# EAGLE design MusicReactiveLEDStrip-V2 (EAGLE 8.4.0)
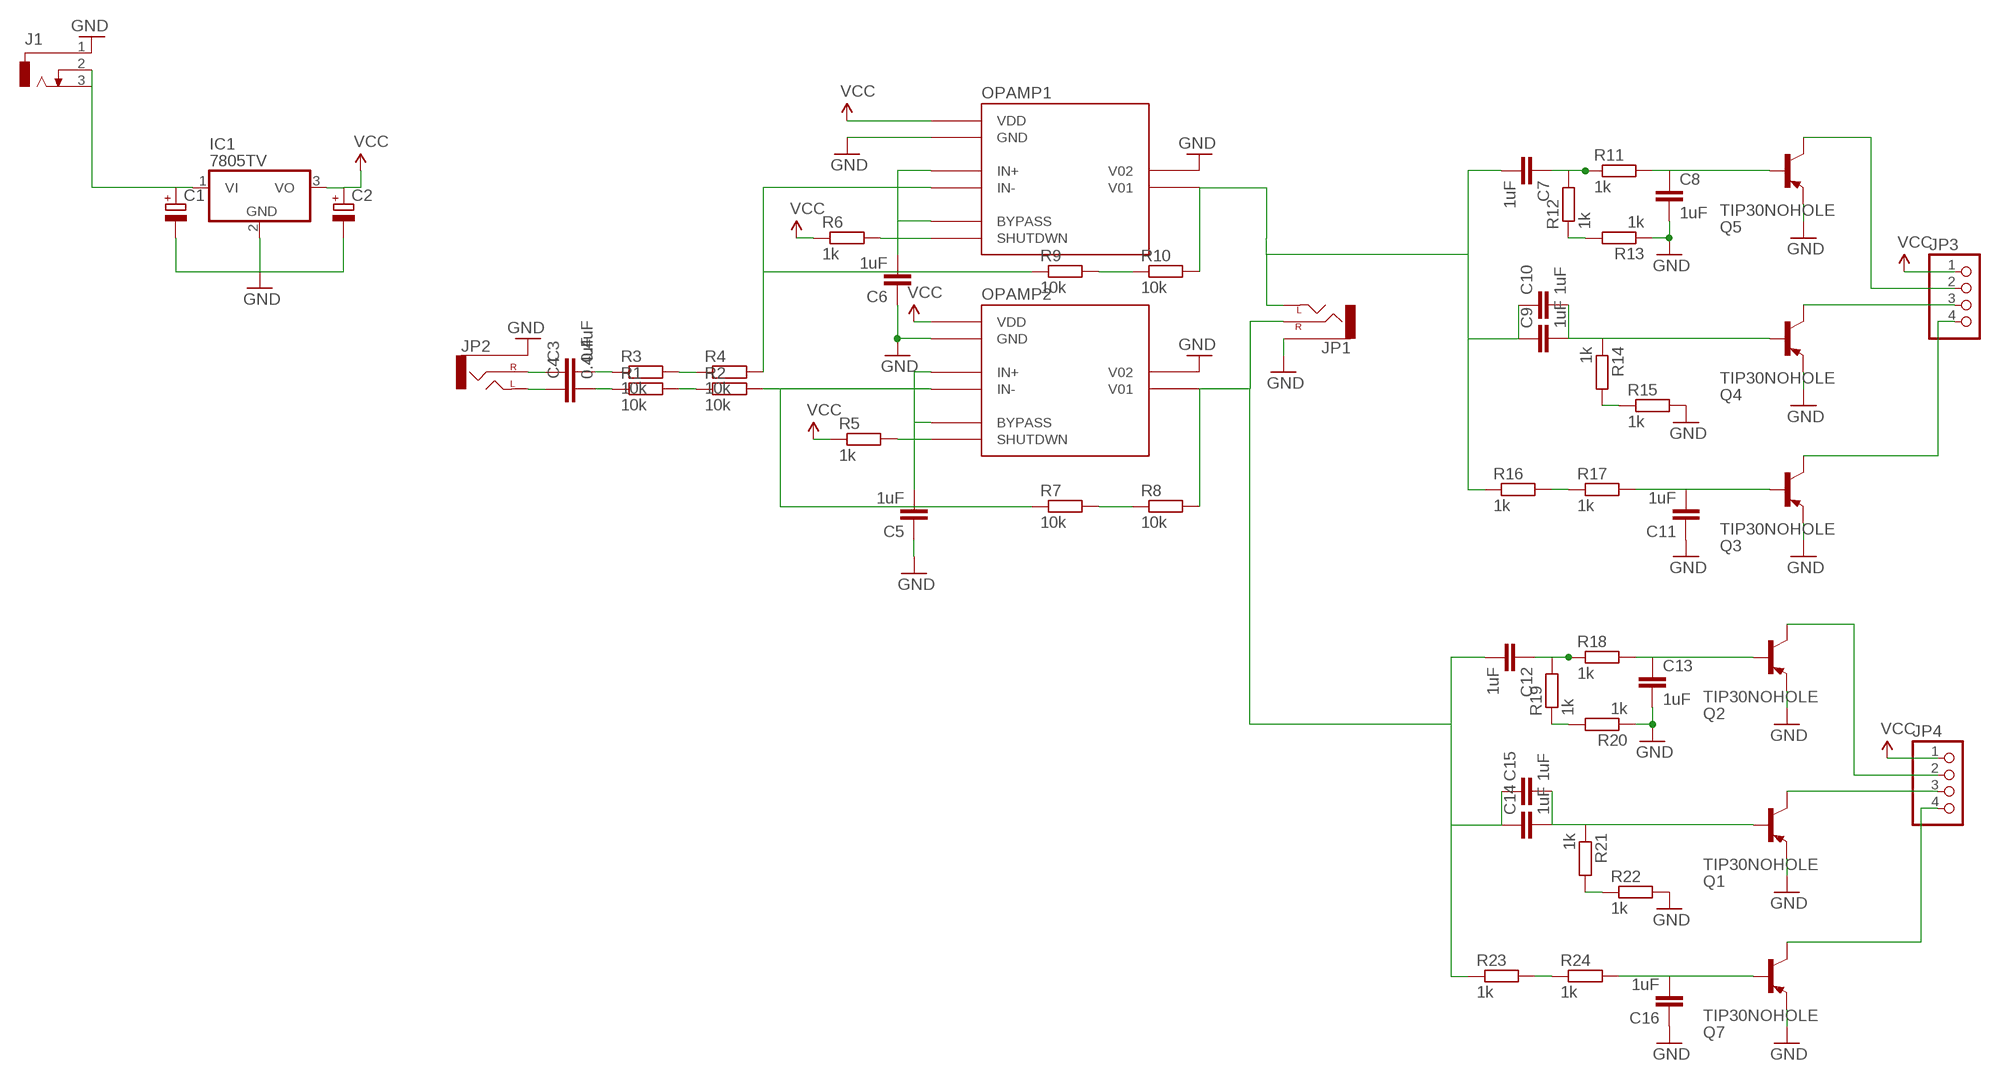
[diagram p0: schematic, sheet 1]

## Parts
C1  CPOL-EUE2.5-6  [E2,5-6]
C2  CPOL-EUE2.5-6  [E2,5-6]
C3  0.4uF  C-EU050-025X075  [C050-025X075]
C4  0.4uF  C-EU050-025X075  [C050-025X075]
C5  1uF  C-EU050-025X075  [C050-025X075]
C6  1uF  C-EU050-025X075  [C050-025X075]
C7  1uF  C-EU050-025X075  [C050-025X075]
C8  1uF  C-EU050-025X075  [C050-025X075]
C9  1uF  C-EU050-025X075  [C050-025X075]
C10  1uF  C-EU050-025X075  [C050-025X075]
C11  1uF  C-EU050-025X075  [C050-025X075]
C12  1uF  C-EU050-025X075  [C050-025X075]
C13  1uF  C-EU050-025X075  [C050-025X075]
C14  1uF  C-EU050-025X075  [C050-025X075]
C15  1uF  C-EU050-025X075  [C050-025X075]
C16  1uF  C-EU050-025X075  [C050-025X075]
IC1  7805TV  [TO220V]
J1  DCJ0303  [DCJ0303]
JP1  AUDIO-JACKPTH  [AUDIO-JACK]
JP2  AUDIO-JACKPTH  [AUDIO-JACK]
JP3  PINHD-1X4  [1X04]
JP4  PINHD-1X4  [1X04]
OPAMP1  LM4871  [SO08]
OPAMP2  LM4871  [SO08]
Q1  TIP30NOHOLE  [TO220-NOHOLE]
Q2  TIP30NOHOLE  [TO220-NOHOLE]
Q3  TIP30NOHOLE  [TO220-NOHOLE]
Q4  TIP30NOHOLE  [TO220-NOHOLE]
Q5  TIP30NOHOLE  [TO220-NOHOLE]
Q7  TIP30NOHOLE  [TO220-NOHOLE]
R1  10k  R-EU_0207/10  [0207/10]
R2  10k  R-EU_0207/10  [0207/10]
R3  10k  R-EU_0207/10  [0207/10]
R4  10k  R-EU_0207/10  [0207/10]
R5  1k  R-EU_0207/10  [0207/10]
R6  1k  R-EU_0207/10  [0207/10]
R7  10k  R-EU_0207/10  [0207/10]
R8  10k  R-EU_0207/10  [0207/10]
R9  10k  R-EU_0207/10  [0207/10]
R10  10k  R-EU_0207/10  [0207/10]
R11  1k  R-EU_0207/10  [0207/10]
R12  1k  R-EU_0207/10  [0207/10]
R13  1k  R-EU_0207/10  [0207/10]
R14  1k  R-EU_0207/10  [0207/10]
R15  1k  R-EU_0207/10  [0207/10]
R16  1k  R-EU_0207/10  [0207/10]
R17  1k  R-EU_0207/10  [0207/10]
R18  1k  R-EU_0207/10  [0207/10]
R19  1k  R-EU_0207/10  [0207/10]
R20  1k  R-EU_0207/10  [0207/10]
R21  1k  R-EU_0207/10  [0207/10]
R22  1k  R-EU_0207/10  [0207/10]
R23  1k  R-EU_0207/10  [0207/10]
R24  1k  R-EU_0207/10  [0207/10]

## Nets
GND: C1.- C2.- C5.1 C6.1 C8.2 C11.1 C13.2 C16.1 IC1.2(GND) J1.1 JP1.SLEEVE JP2.SLEEVE OPAMP1.7(GND) OPAMP1.8(V02) OPAMP2.7(GND) OPAMP2.8(V02) Q1.3(E) Q2.3(E) Q3.3(E) Q4.3(E) Q5.3(E) Q7.3(E) R13.1 R15.2 R20.1 R22.2
LEFT: OPAMP2.4(IN-) R2.2 R7.1
LEFTOUT: C7.2 C9.1 C10.1 JP1.TIP(LEFT) OPAMP1.5(V01) R10.2 R16.1
N$4: R3.2 R4.1
N$5: C3.1 JP2.RING(RIGHT)
N$6: C3.2 R3.1
N$7: C4.1 JP2.TIP(LEFT)
N$8: C4.2 R1.1
N$9: R1.2 R2.1
N$10: OPAMP2.1(SHUTDWN) R5.2
N$11: C5.2 OPAMP2.2(BYPASS) OPAMP2.3(IN+)
N$12: C6.2 OPAMP1.2(BYPASS) OPAMP1.3(IN+)
N$13: OPAMP1.1(SHUTDWN) R6.2
N$14: R7.2 R8.1
N$16: R9.2 R10.1
N$18: C7.1 R11.1 R12.2
N$19: R12.1 R13.2
N$20: C8.1 Q5.1(B) R11.2
N$21: C12.1 R18.1 R19.2
N$23: C9.2 C10.2 Q4.1(B) R14.1
N$24: R14.2 R15.1
N$25: R16.2 R17.1
N$26: C11.2 Q3.1(B) R17.2
N$27: R19.1 R20.2
N$28: JP3.2 Q5.2(C)
N$29: JP3.3 Q4.2(C)
N$30: JP3.4 Q3.2(C)
N$31: C13.1 Q2.1(B) R18.2
N$33: C14.2 C15.2 Q1.1(B) R21.1
N$34: R21.2 R22.1
N$35: R23.2 R24.1
N$36: C16.2 Q7.1(B) R24.2
N$37: JP4.2 Q2.2(C)
N$38: JP4.3 Q1.2(C)
N$39: JP4.4 Q7.2(C)
RIGHT: OPAMP1.4(IN-) R4.2 R9.1
RIGHTOUT: C12.2 C14.1 C15.1 JP1.RING(RIGHT) OPAMP2.5(V01) R8.2 R23.1
VCC: C2.+ IC1.3(VO) JP3.1 JP4.1 OPAMP1.6(VDD) OPAMP2.6(VDD) R5.1 R6.1
VIN: C1.+ IC1.1(VI) J1.2 J1.3

## Library data of the parts
C1 C2 = rcl:CPOL-EU: POLARIZED CAPACITOR, European symbol
C3-C16 = rcl:C-EU: CAPACITOR, European symbol
IC1 = linear:78*: Positive VOLTAGE REGULATOR Source: http://cache.national.com/ds/LM/LM78L05.pdf http://www.fairchildsemi.com/ds/LM/LM7805.pdf
J1 = con-jack:DCJ0303: DC POWER JACK Source: DCJ0303.pdf; OC_FARNELL: unknown; OC_NEWARK: unknown
JP1 JP2 = SparkFun-Connectors:AUDIO-JACK: 3.5mm Audio Jack Simple 3.5mm common PCB mount audio jack. Variant PTH is our storefront SKU PRT-08032
JP3 JP4 = pinhead:PINHD-1X4: PIN HEADER
OPAMP1 OPAMP2 = SparkFun-PowerIC:LM4871: 3W audio amplifier
Q1-Q5 Q7 = adafruit:TIP30: PNP Transistor
R1-R24 = rcl:R-EU_: RESISTOR, European symbol

## Board
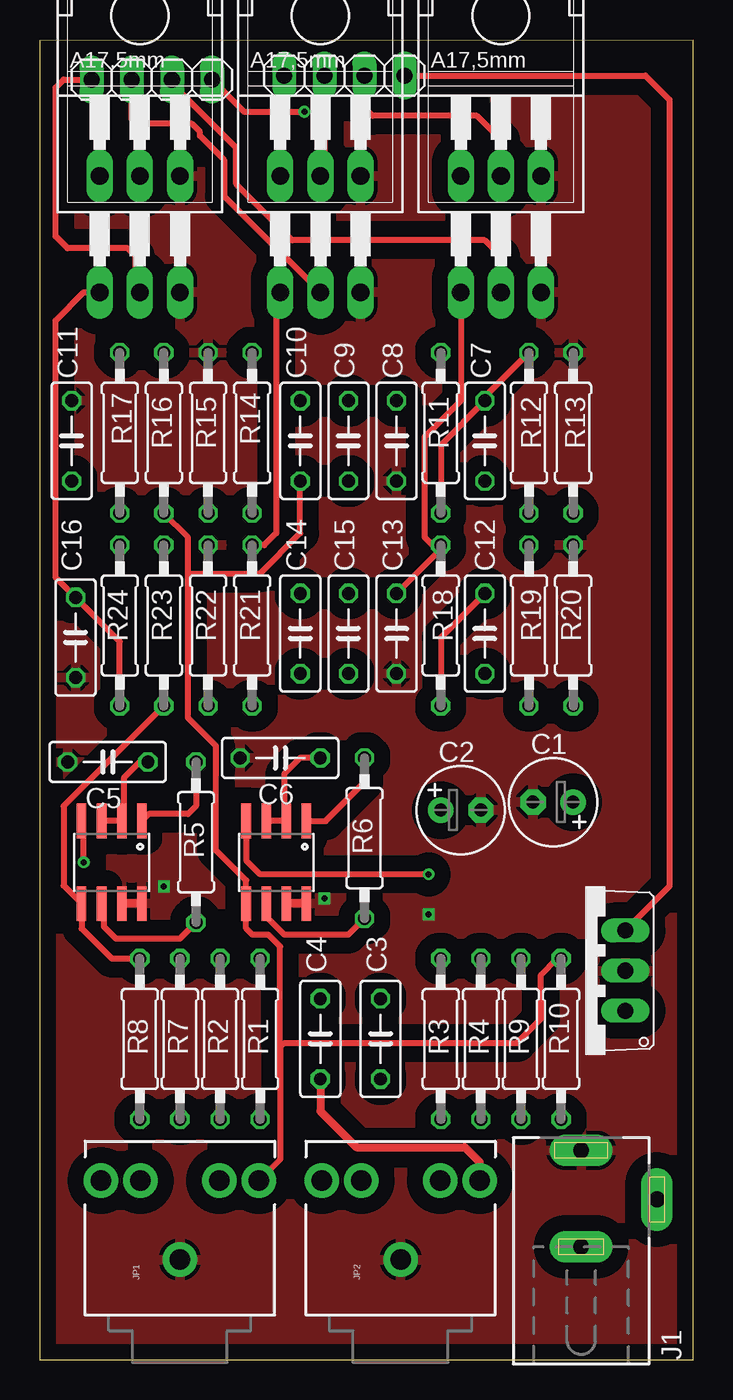
[diagram p1: board, top side]
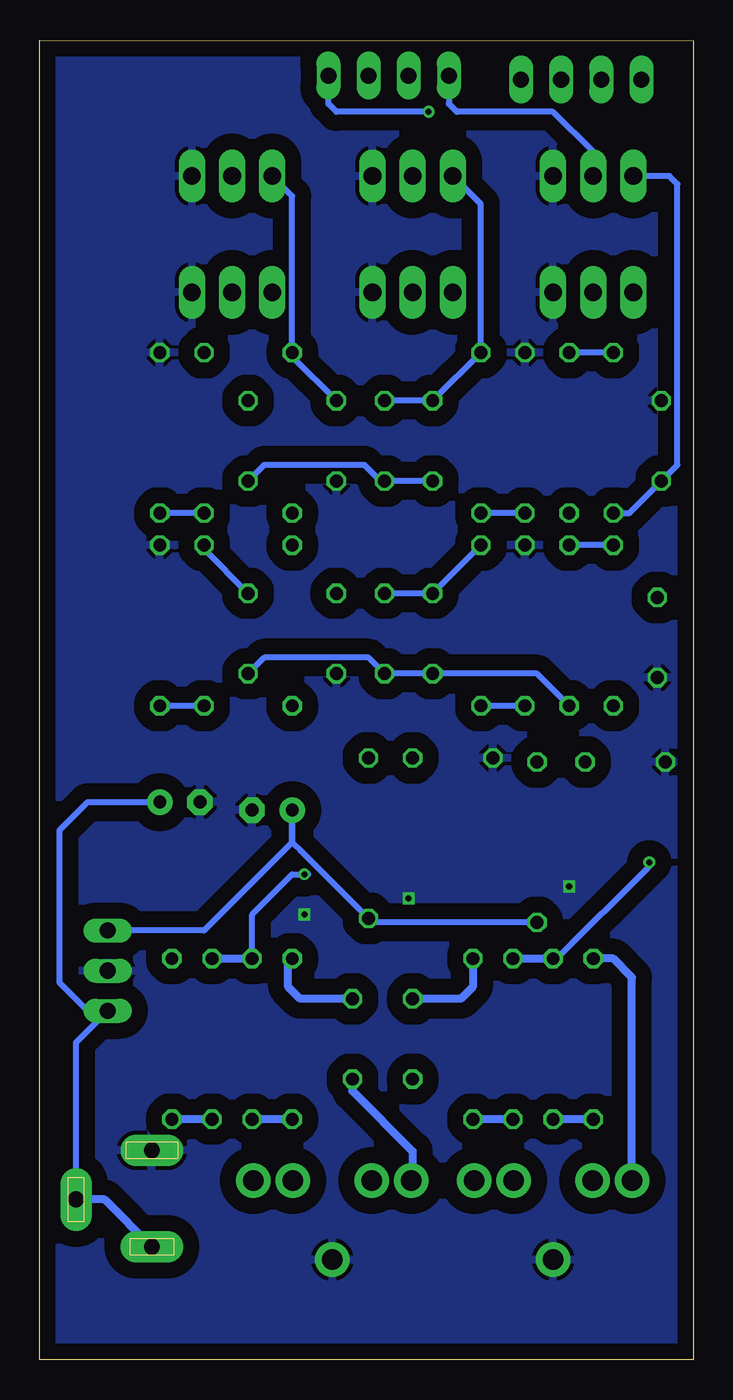
[diagram p2: board, bottom side, seen from below]

Size 41.4 x 83.52 mm. Coordinates in mm from the lower left corner, seen from the top.
Outline: 0,0 41.4,0 41.4,83.52 0,83.49 0,0
Copper layers (1*16): Top 0.0356mm / dielectric 1.5011mm / Bottom 0.0356mm
Design rules "oshpark-2layer": minimum track width 6mil, minimum drill 13mil, track to track 6mil, track to pad 6mil, pad to pad 6mil, via to via 6mil, smd to smd 6mil, copper to edge 15mil, drill to drill 6mil, minimum pad ring 7mil, minimum via ring 7mil, stop-mask expansion 2.5mil, vias tented up to drill 0mil, thermal gap 10mil

### Footprints (pad centres in the part's own frame; a part is rotated, then mirrored left to right if it is on the bottom)
E2,5-6 = drill 0.813 pad 1.6: + -1.27,0 | drill 0.813 pad 1.6 octagon: - 1.27,0
C050-025X075 = drill 0.813 octagon: 1 -2.54,0; 2 2.54,0
TO220V = drill 1.016 long: 1 -2.54,-2.54; 2 0,-2.54; 3 2.54,-2.54
DCJ0303 = drill 1 pad 2 long: 1 0,3.1; 2 4.8,0; 3 0,-3
AUDIO-JACK = drill 1.3 pad 2.184: RING 5,5; RSH 5,2.5; SLEEVE 0,0; TIP 5,-5; TSH 5,-2.5
1X04 = drill 1.016 long: 1 -3.81,0; 2 -1.27,0; 3 1.27,0; 4 3.81,0
SO08 = smd 0.61 x 2.21: 1 -1.905,-2.616; 2 -0.635,-2.616; 3 0.635,-2.616; 4 1.905,-2.616; 5 1.905,2.616; 6 0.635,2.616; 7 -0.635,2.616; 8 -1.905,2.616
TO220-NOHOLE = drill 1.118 long: 1 -2.54,-6.35; 2 0,-6.35; 3 2.54,-6.35
0207/10 = drill 0.813 octagon: 1 -5.08,0; 2 5.08,0

### Placement (x,y rotation side)
C1  32.51,35.31 180 top
C2  26.67,34.8 0 top
C3  21.59,20.32 90 top
C4  17.78,20.32 90 top
C5  4.32,37.85 0 top
C6  15.24,38.1 0 top
C7  28.19,58.17 270 top
C8  22.61,58.17 270 top
C9  19.56,58.17 90 top
C10  16.51,58.17 90 top
C11  2.03,58.17 270 top
C12  28.19,45.97 270 top
C13  22.61,45.97 270 top
C14  16.51,45.97 90 top
C15  19.56,45.97 90 top
C16  2.29,45.72 90 top
IC1  34.54,24.64 90 top
J1  34.29,10.16 0 top
JP1  8.89,6.35 90 top
JP2  22.86,6.35 90 top
JP3  19.3,81.28 180 top
JP4  7.11,81.03 180 top
OPAMP1  14.99,31.5 180 top
OPAMP2  4.57,31.5 180 top
Q1  17.78,73.91 0 top
Q2  29.21,73.91 0 top
Q3  6.35,81.28 0 top
Q4  17.78,81.28 0 top
Q5  29.21,81.28 0 top
Q7  6.35,73.91 0 top
R1  13.97,20.32 270 top
R2  11.43,20.32 90 top
R3  25.4,20.32 270 top
R4  27.94,20.32 90 top
R5  9.91,32.77 90 top
R6  20.57,33.02 90 top
R7  8.89,20.32 270 top
R8  6.35,20.32 90 top
R9  30.48,20.32 270 top
R10  33.02,20.32 90 top
R11  25.4,58.67 90 top
R12  30.99,58.67 90 top
R13  33.78,58.67 270 top
R14  13.46,58.67 270 top
R15  10.67,58.67 90 top
R16  7.87,58.67 90 top
R17  5.08,58.67 270 top
R18  25.4,46.48 90 top
R19  30.99,46.48 90 top
R20  33.78,46.48 270 top
R21  13.46,46.48 270 top
R22  10.67,46.48 90 top
R23  7.87,46.48 90 top
R24  5.08,46.48 270 top

### Tracks (layer width: path | path; a pad name or v marks a point on that pad's centre or on a via)
GND  (via drill 0.38)
  Top 0.508: OPAMP1.8 OPAMP1.7 | OPAMP2.8 OPAMP2.7
  other vias: 7.87,29.97 18.03,29.21 24.64,28.19
  pour Bottom (isolate 1.016): 0,0 0,83.57 41.4,83.57 41.4,0
  pour Top (isolate 1.016): 0,0 41.4,0 41.4,83.57 0,83.57
LEFT  (via drill 0.38)
  Top 0.381: v2.79,31.5 2.79,33.98 OPAMP2.4
  Bottom 0.381: R7.1 8.64,25.4 2.79,31.24 v2.79,31.5
  Bottom 0.508: R2.2 R7.1
LEFTOUT
  Top 0.381: JP1.TIP 15.24,12.7 15.24,19.81 | 15.24,19.81 15.24,26.16 14.48,26.92 13.46,26.92 13.08,27.3 OPAMP1.5 13.08,30.35 11.18,32.26 11.18,38.86 9.4,40.64 9.4,49.78 | 15.24,19.81 15.49,20.07 30.23,20.07 31.75,21.59 31.75,24.38 32.77,25.4 R10.2 | 9.4,49.78 9.4,52.07 R16.1 | 9.4,49.78 13.97,49.78 16.51,52.32 C10.1
  Bottom 0.381: C10.1 C9.1 19.81,55.63 20.83,56.64 27.18,56.64 C7.2
N$4
  Bottom 0.508: R3.2 R4.1
N$5
  Bottom 0.508: C3.1 21.59,17.02 17.78,13.21 17.78,11.43 JP2.RING
N$6
  Bottom 0.508: C3.2 24.89,22.86 25.65,23.62 25.65,25.15 R3.1
N$7
  Top 0.508: C4.1 17.78,15.75 20.07,13.46 26.92,13.46 27.86,12.53 JP2.TIP
N$8
  Bottom 0.508: R1.1 13.97,23.62 14.73,22.86 C4.2
N$9
  Bottom 0.508: R2.1 R1.2
N$10
  Top 0.381: R5.2 9.91,35.05 9.4,34.54 6.91,34.54 OPAMP2.1
N$11
  Top 0.381: 5.08,34.11 OPAMP2.3 | 5.08,34.11 OPAMP2.2 | C5.2 6.35,37.85 5.33,36.83 5.33,34.37 5.08,34.11
N$12
  Top 0.381: C6.2 16.51,38.1 15.49,37.08 15.49,34.24 OPAMP1.2 OPAMP1.3
N$13
  Top 0.381: OPAMP1.1 18.11,34.11 20.57,36.58 R6.2
N$14
  Bottom 0.508: R8.1 R7.2
N$16
  Bottom 0.508: R9.2 R10.1
N$18
  Top 0.381: R11.1 25.4,57.91 C7.1 28.19,60.96 R12.2
N$19
  Bottom 0.381: R12.1 R13.2
N$20
  Bottom 0.381: C8.1 25.4,63.5 R11.2 25.4,73.66 Q5.1
N$21
  Top 0.381: C12.1 25.4,45.72 R18.1
  Bottom 0.381: R19.2 30.99,51.31 C12.1
N$23
  Bottom 0.381: C9.2 16.76,60.71 C10.2 R14.1 13.46,73.15 Q4.1
N$24
  Bottom 0.381: R15.1 R14.2
N$25
  Bottom 0.381: R17.1 R16.2
N$26
  Bottom 0.381: R17.2 4.06,53.59 C11.2 1.02,56.64 1.02,74.42 1.52,74.93 Q3.1
N$27
  Bottom 0.381: R19.1 R20.2
N$28
  Top 0.381: JP3.2 20.57,79.25 21.08,78.74 27.69,78.74 29.21,77.22 Q5.2
N$29
  Top 0.381: 17.78,81.03 JP3.3 18.03,75.18 Q4.2
N$30
  Bottom 0.381: JP3.4 15.49,81.18 15.49,81.03 15.49,79.5 14.99,78.99 8.89,78.99 6.35,76.45 Q3.2
N$31
  Top 0.381: C13.1 25.4,51.31 R18.2 24.89,51.56 24.38,52.07 24.38,58.42 26.67,60.71 Q2.1
N$33
  Top 0.381: R21.1 14.22,51.56 14.99,52.32 14.99,67.31 Q1.1
  Bottom 0.381: C15.2 C14.2 R21.1
N$34
  Bottom 0.381: R22.1 R21.2
N$35
  Bottom 0.381: R24.1 R23.2
N$36
  Top 0.381: R24.2 5.08,45.47 C16.2 1.02,49.53 1.02,65.79 2.79,67.56 Q7.1
N$37
  Top 0.381: JP4.2 8.38,80.77 12.45,76.71 12.45,74.42 16,70.87 28.19,70.87 29.21,69.85 Q2.2
N$38
  Top 0.381: JP4.3 5.84,78.49 6.1,78.23 9.65,78.23 10.16,77.72 10.16,77.47 11.68,75.95 11.68,73.66 Q1.2
N$39
  Top 0.381: JP4.4 1.52,81.03 1.02,80.52 1.02,71.12 1.78,70.36 5.59,70.36 6.1,69.85 6.1,67.82 Q7.2
RIGHT  (via drill 0.38)
  Top 0.381: OPAMP1.4 13.08,31.62 13.97,30.73 v24.64,30.73
  Bottom 0.381: R4.2 27.94,28.19 25.4,30.73 v24.64,30.73 | v24.64,30.73 24.38,30.73 v24.64,30.73
  Bottom 0.508: R9.1 R4.2
RIGHTOUT
  Top 0.381: R8.2 4.57,25.4 2.67,27.3 OPAMP2.5 1.52,30.02 1.52,35.05 R23.1
  Bottom 0.381: C12.2 27.18,44.45 20.57,44.45 C15.1 C14.1 9.91,43.43 R23.1
  Bottom 0.508: JP1.RING 3.89,24.21 5.08,25.4 R8.2
VCC  (via drill 0.38)
  Top 0.381: OPAMP1.6 14.35,28.07 15.49,26.92 19.56,26.92 R6.1 | OPAMP2.6 4.06,28.75 4.06,27.43 4.83,26.67 8.89,26.67 R5.1 | JP3.1 38.35,81.28 39.88,79.76 39.88,29.97 IC1.3 | JP4.1 12.95,78.99 v16.76,78.99
  Bottom 0.381: IC1.3 30.99,27.18 25.4,32.77 | 24.77,32.13 R6.1 20.32,27.69 R5.1 | 24.77,32.13 24.89,32.26 | 25.4,32.77 C2.+ 25.4,32.77 | 25.4,32.77 24.77,32.13 | v16.76,78.99 22.61,78.99 23.11,79.5 JP3.1
VIN
  Bottom 0.381: J1.2 39.09,20.09 IC1.1 38.35,22.1 40.13,23.88 40.13,33.53 38.35,35.31 C1.+
  Bottom 0.508: J1.2 37.29,10.16 J1.3